# EAGLE design ECG Single Lead board version 6 (EAGLE 9.5.0)
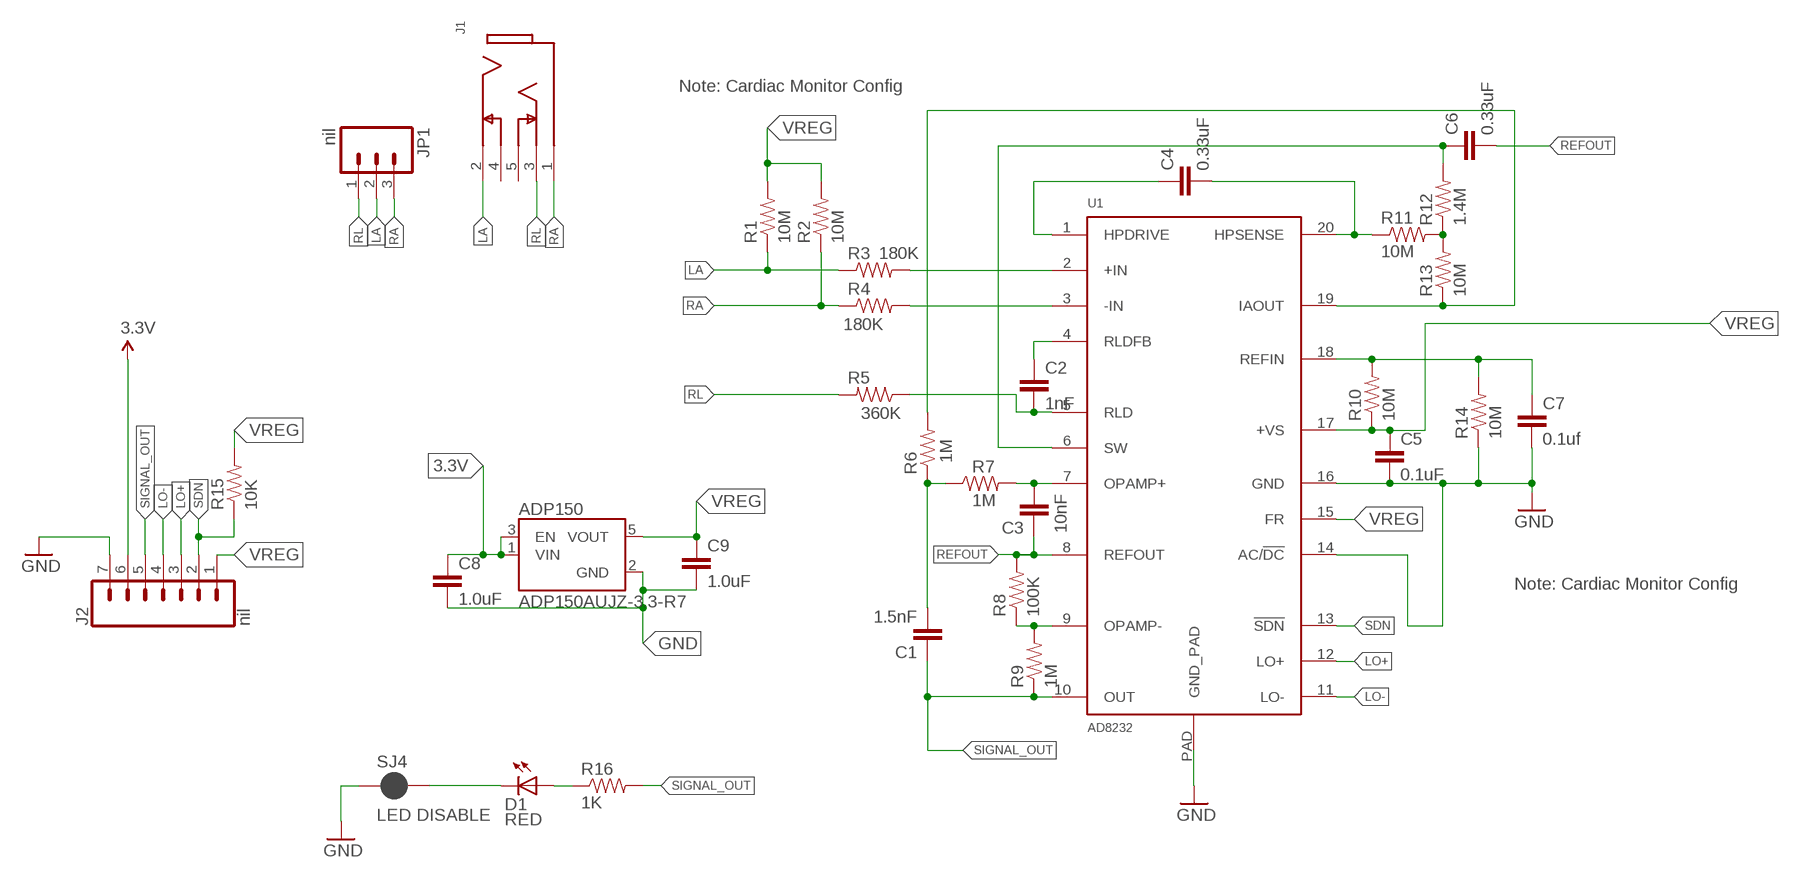
[diagram p0: schematic, sheet 1]

## Parts
ADP150  ADP150AUJZ-3.3-R7  ADP150AUJZ-2.0-R7  [SOT95P280X100-5N]
C1  1.5nF  CAP0603-CAP  [0603-CAP]
C2  1nF  CAP0603-CAP  [0603-CAP]
C3  10nF  CAP0603-CAP  [0603-CAP]
C4  0.33uF  CAP0805  [0805]
C5  0.1uF  CAP0603-CAP  [0603-CAP]
C6  0.33uF  CAP0805  [0805]
C7  0.1uf  CAP0603-CAP  [0603-CAP]
C8  1.0uF  1.0UF-0603-16V-10%  [0603]
C9  1.0uF  1.0UF-0603-16V-10%  [0603]
D1  RED  LED-RED0603  [LED-0603]
J1  35RASMT4BHNTRX  [SWITCHCRAFT_35RASMT4BHNTRX]
J2  nil  CONN_07  [1X07]
JP1  nil  M03PTH  [1X03]
R1  10M  RESISTOR0603-RES  [0603-RES]
R2  10M  RESISTOR0603-RES  [0603-RES]
R3  180K  RESISTOR0603-RES  [0603-RES]
R4  180K  RESISTOR0603-RES  [0603-RES]
R5  360K  RESISTOR0603-RES  [0603-RES]
R6  1M  RESISTOR0603-RES  [0603-RES]
R7  1M  RESISTOR0603-RES  [0603-RES]
R8  100K  RESISTOR0603-RES  [0603-RES]
R9  1M  RESISTOR0603-RES  [0603-RES]
R10  10M  RESISTOR0603-RES  [0603-RES]
R11  10M  RESISTOR0603-RES  [0603-RES]
R12  1.4M  RESISTOR0603-RES  [0603-RES]
R13  10M  RESISTOR0603-RES  [0603-RES]
R14  10M  RESISTOR0603-RES  [0603-RES]
R15  10K  10KOHM1/10W1%(0603)0603  [0603-RES]
R16  1K  1K-1%  [0603-RES]
SJ4  LED DISABLE  JUMPER-SMT_2_NC_PASTE_SILK  [SMT-JUMPER_2_NC_PASTE_SILK]
U1  AD8232  [LFCSP_20]

## Nets
3.3V: ADP150.1(VIN) ADP150.3(EN) C8.1 J2.6
GND: ADP150.2(GND) C5.2 C7.2 C8.2 C9.2 J2.7 R14.1 SJ4.1 U1.14(AC/!DC) U1.16(GND) U1.PAD(GND_PAD)
LA: J1.2 JP1.2 R1.1 R3.1
LO+: J2.3 U1.12(LO+)
LO-: J2.4 U1.11(LO-)
N$1: R3.2 U1.2(+IN)
N$2: R4.2 U1.3(-IN)
N$3: C3.2 R7.2 U1.7(OPAMP+)
N$4: C4.2 R11.1 U1.20(HPSENSE)
N$5: C7.1 R10.2 R14.2 U1.18(REFIN)
N$6: D1.A R16.1
N$7: R8.1 R9.2 U1.9(OPAMP-)
N$8: R6.2 R13.1 U1.19(IAOUT)
N$9: C1.2 R6.1 R7.1
N$10: D1.C SJ4.2
N$13: C4.1 U1.1(HPDRIVE)
N$14: R11.2 R12.1 R13.2
N$16: C6.1 R12.2 U1.6(SW)
N$17: C2.1 U1.4(RLDFB)
N$18: C2.2 R5.1 U1.5(RLD)
RA: J1.1 JP1.3 R2.1 R4.1
REFOUT: C3.1 C6.2 R8.2 U1.8(REFOUT)
RL: J1.3 JP1.1 R5.2
SDN: J2.2 R15.1 U1.13(!SDN)
SIGNAL_OUT: C1.1 J2.5 R9.1 R16.2 U1.10(OUT)
VREG: ADP150.5(VOUT) C5.1 C9.1 J2.1 R1.2 R2.2 R10.1 R15.2 U1.15(FR) U1.17(+VS)
Unconnected: J1.4 J1.5

## Notes on the sheet
- Note: Cardiac Monitor Config
- Note: Cardiac Monitor Config

## Library data of the parts
ADP150 = ADP150AUJZ-2.0-R7:ADP150AUJZ-2.0-R7: IC REG LINEAR 2V 150MA 5TSOT; DESCRIPTION: LDO Regulator Pos 2V 0.15A 5-Pin TSOT T/R; DIGI-KEY_PART_NUMBER: ADP150AUJZ-2.0-R7CT-ND; DIGI-KEY_PURCHASE_URL: https://www.digikey.in/product-detail/en/analog-devices-inc/ADP150AUJZ-2.0-R7/ADP150AUJZ-2.0-R7CT-ND/5583173?utm_source=snapeda&utm_medium=aggregator&utm_campaign=symbol; MF: Analog Devices; MP: ADP150AUJZ-2.0-R7; PACKAGE: TSOT-23 Analog Devices
C1-C7 = SparkFun-Passives:CAP: Capacitor Standard 0603 ceramic capacitor, and 0.1" leaded capacitor.
C8 C9 = SparkFun-Capacitors:1.0UF: 1µF ceramic capacitors A capacitor is a passive two-terminal electrical component used to store electrical energy temporarily in an electric field.; PROD_ID: CAP-00868
D1 = SparkFun-LED:LED-RED: Assorted Red LEDs LilyPad 1206- DIO-09912 1206- DIO-00809 0603- DIO-00819; PROD_ID: DIO-00819
J1 = Switchcraft 3.5 mm smd audio jack:35RASMT4BHNTRX: Conn 3.5MM Stereo Jack F 3 POS Solder RA SMD 5 Terminal 1 Port T/R; AVAILABILITY: Unavailable; DESCRIPTION: Conn 3.5MM Stereo Jack F 3 POS Solder RA SMD 5 Terminal 1 Port T/R; MF: Switchcraft; MP: 35RASMT4BHNTRX; PACKAGE: None; PRICE: None
J2 = SparkFun-Connectors:CONN_07: Multi connection point. Often used as Generic Header-pin footprint for 0.1 inch spaced/style header connections On any of the 0.1 inch spaced packages, you can populate with these: Break Away Headers - Straight <https://www.sparkfun.com/products/116> (PRT-00116) Break Away Male Headers - Right Angle <https://www.sparkfun.com/products/553> (PRT-00553) Female Headers <https://www.sparkfun.com/products/115> (PRT-00115) Break Away Headers - Machine Pin <https://www.sparkfun.com/products/117> (PRT-00117) Break Away Female Headers - Swiss Machine Pin <https://www.sparkfun.com/products/743> (PRT-00743) For SCREWTERMINALS and SPRING TERMINALS visit here: Screw Terimnals on SparkFun.com <https://www.sparkfun.com/search/results?term=Screw+Terminals> (5mm/3.5mm/2.54mm spacing) This device is also useful as a general connection point to wire up your design to another part of your project. Our various solder wires solder well into these plated through hole pads. Hook-Up Wire - Assortment (Stranded, 22 AWG) <https://www.sparkfun.com/products/11375> (PRT-11375) Hook-Up Wire - Assortment (Solid Core, 22 AWG) <https://www.sparkfun.com/products/11367> (PRT-11367) View the entire wire category on our website here <https://www.sparkfun.com/categories/141> Special notes: Molex polarized connector foot print use with SKU : PRT-08231 with associated crimp pins and housings. 1MM SMD Version SKU: PRT-10208 NOTES ON THE VARIANTS LOCK and LOCK_LONGPADS... This footprint was designed to help hold the alignment of a through-hole component (i.e. 6-pin header) while soldering it into place. You may notice that each hole has been shifted either up or down by 0.005 of an inch from it's more standard position (which is a perfectly straight line). This slight alteration caused the pins (the squares in the middle) to touch the edges of the holes. Because they are alternating, it causes a "brace" to hold the component in place. 0.005 has proven to be the perfect amount of "off-center" position when using our standard breakaway headers. Although looks a little odd when you look at the bare footprint, once you have a header in there, the alteration is very hard to notice. Also,if you push a header all the way into place, it is covered up entirely on the bottom side.
JP1 = SparkFun-Connectors:M03: Header 3 Standard 3-pin 0.1" header. Use with straight break away headers (SKU : PRT-00116), right angle break away headers (PRT-00553), swiss pins (PRT-00743), machine pins (PRT-00117), and female headers (PRT-00115). Molex polarized connector foot print use with SKU : PRT-08232 with associated crimp pins and housings.
R1-R14 = SparkFun-Passives:RESISTOR: Resistor Basic schematic elements and footprints for 0603, 1206, and PTH resistors.
R15 = SparkFun-Resistors:10KOHM1/10W1%(0603): RES-00824; PROD_ID: RES-00824
R16 = SparkFun-Resistors:1K-1%: 1k-ohm SMT 1/10W - 1% (0603) RES-07856; PROD_ID: RES-07856; VALUE: 1k
SJ4 = SparkFun-Jumpers:JUMPER-SMT_2_NC_PASTE: Normally closed solder jumper This jumper has an aperture in the stencil to allow solder paste to bridge the split in the wire so it's normally closed (NC). Wick off the solder to open the connection. Reapply solder to reclose the connection.
U1 = AD8232:AD8232

## Board
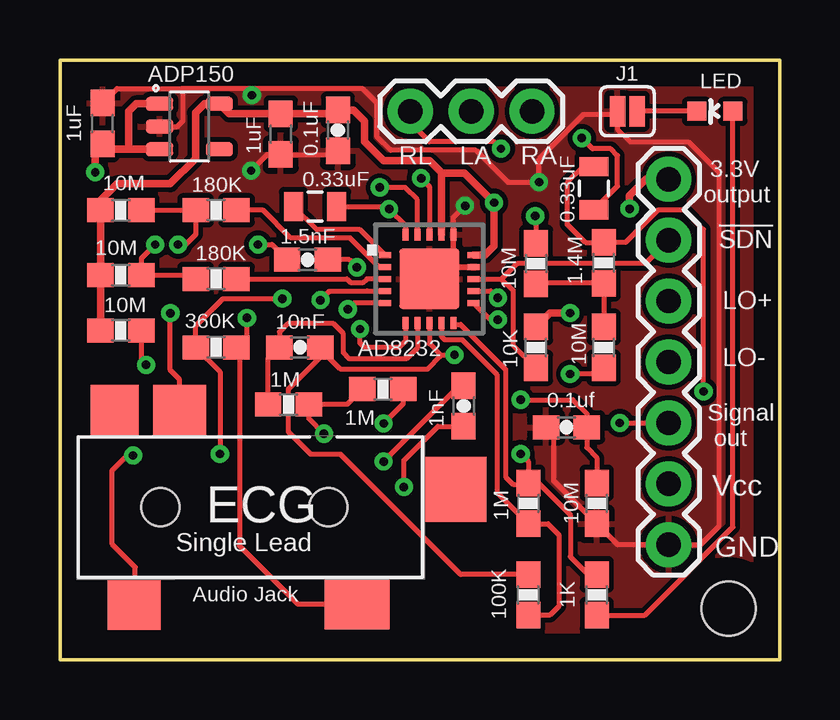
[diagram p1: board, top side]
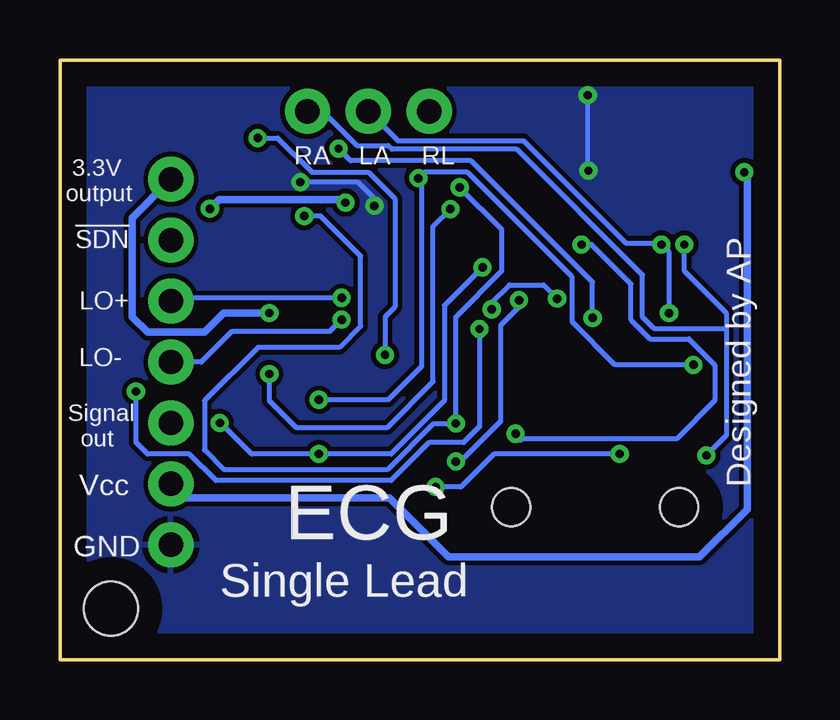
[diagram p2: board, bottom side, seen from below]

Size 30 x 25 mm. Coordinates in mm from the lower left corner, seen from the top.
Outline: 0,0 0,25 30,25 30,0 0,0
Copper layers (1*16): Top 0.035mm / dielectric 1.5mm / Bottom 0.035mm
Design rules "default": minimum track width 6mil, minimum drill 0.35mm, track to track 6mil, track to pad 6mil, pad to pad 6mil, via to via 6mil, smd to smd 6mil, copper to edge 40mil, drill to drill 6mil, minimum pad ring 10mil, minimum via ring 8mil, stop-mask expansion 4mil, vias tented up to drill 0mil, thermal gap 10mil
Holes 2.25 mm at 27.87,2.13

### Footprints (pad centres in the part's own frame; a part is rotated, then mirrored left to right if it is on the bottom)
SOT95P280X100-5N = smd 1.14 x 0.59: 1 -1.245,0.95; 2 -1.245,0; 3 -1.245,-0.95; 4 1.245,-0.95; 5 1.245,0.95
0603-CAP = smd 1.1 x 1: 1 -0.85,0; 2 0.85,0
0805 = smd 0.8 x 1.2: 1 -0.9,0; 2 0.9,0
0603 = smd 1.1 x 1: 1 -0.85,0; 2 0.85,0
LED-0603 = smd 0.8 x 0.8: A 0,-0.75; C 0,0.75
SWITCHCRAFT_35RASMT4BHNTRX = smd 2.2 x 2.1: 1 -4.85,-4.05; 2 -2.95,4.05 | smd 2.7 x 2.1: 3 4.45,-4.048 | smd 2 x 2.1: 4 -5.65,4.05 | smd 2.6 x 2.7: 5 8.553,0.748 | hole 1.6: -3.75,0; 3.25,0
1X07 = drill 1.016 pad 1.88: 1 0,0; 2 2.54,0; 3 5.08,0; 4 7.62,0; 5 10.16,0; 6 12.7,0; 7 15.24,0
1X03 = drill 1.016 pad 1.88: 1 0,0; 2 2.54,0; 3 5.08,0
0603-RES = smd 1.1 x 1: 1 -0.85,0; 2 0.85,0
SMT-JUMPER_2_NC_PASTE_SILK = smd 0.635 x 1.27: 1 -0.406,0; 2 0.406,0
LFCSP_20 = smd 0.5 x 0.25: 1 -1.85,1; 2 -1.85,0.5; 3 -1.85,0; 4 -1.85,-0.5; 5 -1.85,-1; 11 1.85,-1; 12 1.85,-0.5; 13 1.85,0; 14 1.85,0.5; 15 1.85,1 | smd 0.25 x 0.5: 6 -1,-1.85; 7 -0.5,-1.85; 8 0,-1.85; 9 0.5,-1.85; 10 1,-1.85; 16 1,1.85; 17 0.5,1.85; 18 0,1.85; 19 -0.5,1.85; 20 -1,1.85 | smd 2.5 x 2.5: PAD 0,0

### Placement (x,y rotation side)
ADP150  5.4,22.23 0 top
C1  10.32,16.67 180 top
C2  16.83,10.57 270 top
C3  10,13.02 180 top
C4  10.64,18.89 0 top
C5  11.59,22.07 270 top
C6  22.26,19.65 270 top
C7  21.11,9.68 180 top
C8  1.78,22.35 90 top
C9  9.21,21.91 270 top
D1  27.3,22.86 90 top
J1  7.94,6.35 0 top
J2  25.38,20.03 270 top
JP1  14.61,22.86 0 top
R1  2.54,18.73 180 top
R2  2.54,16.03 180 top
R3  6.51,18.73 0 top
R4  6.51,15.88 0 top
R5  6.51,13.02 0 top
R6  13.46,11.27 0 top
R7  9.53,10.64 180 top
R8  19.53,2.7 90 top
R9  19.53,6.51 270 top
R10  2.54,13.72 0 top
R11  22.67,13.02 90 top
R12  22.67,16.54 90 top
R13  19.84,16.51 270 top
R14  22.38,6.51 90 top
R15  19.84,13.02 90 top
R16  22.38,2.7 90 top
SJ4  23.65,22.86 0 top
U1  15.4,15.88 0 top

### Tracks (layer width: path | path; a pad name or v marks a point on that pad's centre or on a via)
3.3V  (via drill 0.35)
  Top 0.305: 2.86,21.27 2,21.27 C8.1 1.47,21.19 v1.47,20.32 | 2.86,21.27 ADP150.3 | ADP150.1 3.17,23.18 2.86,22.86 2.86,21.27
  Bottom 0.305: v1.47,20.32 1.35,20.2 1.35,6.27 3.33,4.29 13.81,4.29 16.26,6.73 24.78,6.73 J2.6
GND  (via drill 0.35)
  Top 0.203: C8.2 2.38,23.81 5.08,23.81 | C5.2 11.43,21.06 C9.2 8.64,21.06 v7.97,20.38 | C7.2 20.58,9.37 20.58,7.46 R14.1 23.26,4.79 J2.7 25.4,4.76 26.67,4.76 27.46,5.56 27.46,20.32 26.19,21.59 23.78,21.59 23.25,22.12 23.25,22.73 | SJ4.1 23.25,22.73 | ADP150.2 4.89,22.23 5.13,22.46 5.13,23.76 5.08,23.81 | U1.PAD 15.9,16.38 U1.14 16.49,16.38 16.35,16.51 16.4,16.56 U1.16 16.4,18.43 v16.89,18.92 | 23.25,22.73 21.85,22.73 19.97,20.86 v19.97,19.91 18.67,19.91 17.34,21.23 13.79,21.23 13.21,21.81 13.21,23.21 12.61,23.81 8,23.81 | 8,23.81 5.08,23.81 | v8,23.53 8,23.81
  Bottom 0.203: v16.89,18.92 16.89,19.21 17.58,19.91 v19.97,19.91 | v7.97,20.38 8,20.41 v8,23.53
  pour Top (isolate 0.203): 0,25 0,0 30,0 30,25
  pour Bottom (isolate 0.203): 0,25 0,0 30,0 30,25
LA  (via drill 0.35)
  Top 0.203: R1.1 R3.1 5.66,17.72 5.24,17.3 v4.92,17.3 | J1.2 4.99,11.68 4.6,12.06 v4.6,14.44
  Bottom 0.203: JP1.2 15.91,21.63 10.67,21.63 6.41,17.37 4.99,17.37 v4.92,17.3 4.79,17.18 4.76,17.14 4.6,16.99 v4.6,14.44
LO+  (via drill 0.35)
  Top 0.203: U1.12 17.96,15.38 v18.26,15.08
  Bottom 0.203: v18.26,15.08 25.24,15.08 J2.3
LO-  (via drill 0.35)
  Top 0.203: U1.11 17.95,14.17 v18.26,14.17
  Bottom 0.203: v18.26,14.17 18.73,13.7 22.82,13.7 24.11,12.41 J2.4
N$1
  Top 0.203: U1.2 13.31,16.38 12.1,17.58 9.62,17.58 8.47,18.73 R3.2
N$2
  Top 0.203: U1.3 12.8,15.88 12.64,15.72 12.12,15.72 11.96,15.88 R4.2
N$3
  Top 0.203: R7.2 8.68,12.54 C3.2 9.15,13.66 9.49,14 11.4,14 11.81,13.59 11.81,12.79 12.06,12.54 14.45,12.54 14.9,12.99 U1.7
N$4  (via drill 0.35)
  Top 0.203: R11.1 22.41,11.91 v21.27,11.91 | U1.20 14.4,18.11 v13.72,18.79 13.62,18.89 C4.2
  Bottom 0.203: v21.27,11.91 21.27,10.79 20.16,9.68 16.35,9.68 14.45,11.59 14.45,18.07 v13.72,18.79
N$5  (via drill 0.35)
  Top 0.203: R14.2 22.38,8.41 21.96,8.83 C7.1 21.96,10.26 21.39,10.83 v19.21,10.83 | v15.06,20.07 15.4,19.73 U1.18 | R10.2 3.39,12.48 v3.59,12.29
  Bottom 0.203: v3.59,12.29 6.86,12.29 8.64,14.06 8.64,15.94 13.02,20.32 14.81,20.32 v15.06,20.07 14.92,19.93 14.92,12.22 16.31,10.83 v19.21,10.83
N$6
  Top 0.203: R16.1 24.38,1.85 28.05,5.53 D1.A
N$7
  Top 0.203: U1.9 15.9,13.47 16.03,13.34 16.76,13.34 18.22,11.88 18.22,6.97 R9.2 20.34,5.66 20.8,5.21 20.8,2.22 20.42,1.85 R8.1
N$8  (via drill 0.35)
  Top 0.203: R6.2 14.31,10.66 v13.49,9.84 | v13.34,19.68 14.39,19.68 14.9,19.17 U1.19 | v19.81,18.49 19.84,18.46 R13.1
  Bottom 0.203: v13.34,19.68 11.59,17.94 11.59,16.19 13.49,14.29 v13.49,9.84 14.42,9.84 16.32,7.94 23.18,7.94 23.97,8.73 23.97,10.79 21.75,13.02 18.35,13.02 17.46,13.91 17.46,16.83 19.13,18.49 v19.81,18.49
N$9  (via drill 0.35)
  Top 0.203: R6.1 11.98,10.64 R7.1 10.38,10.04 v11,9.42 | v8.26,17.3 8.83,17.3 C1.2
  Bottom 0.203: 10.79,9.21 4.29,9.21 2.7,10.79 2.7,12.29 3.78,13.37 5.4,13.37 6.19,14.16 6.19,15.66 7.84,17.3 v8.26,17.3
  Bottom 0.305: 10.79,9.21 v11,9.42
N$10
  Top 0.203: D1.C SJ4.2
N$13
  Top 0.203: C4.1 10.69,17.94 12.48,17.94 U1.1
N$14
  Top 0.203: R13.2 19.88,15.69 R12.1 R11.2
N$16  (via drill 0.35)
  Top 0.203: C6.1 21.82,20.55 21.14,19.88 21.14,18.15 21.91,17.39 R12.2 23.58,17.39 24.92,18.73 26.04,18.73 26.83,17.94 v26.83,11.18 | U1.6 14.4,13.29 14.13,13.02 12.7,13.02 12.51,13.21 v12.51,13.78
  Bottom 0.203: v12.51,13.78 12.51,9.72 13.18,9.05 14.61,9.05 16.19,7.46 23.5,7.46 24.61,8.57 26.35,8.57 26.83,9.05 v26.83,11.18
N$17  (via drill 0.35)
  Top 0.203: C2.1 16.66,11.42 v13.49,8.26 | U1.4 12.8,15.38 12.79,15.36 11.24,15.36 v10.86,14.99
  Bottom 0.203: v13.49,8.26 13.31,8.26 11.62,9.94 11.62,13.94 10.86,14.7 v10.86,14.99
N$18  (via drill 0.35)
  Top 0.203: v6.67,8.57 6.67,12.01 R5.1 5.66,13.91 6.79,15.05 v9.27,15.05 | C2.2 15.76,9.72 14.34,8.3 v14.34,7.19 | v12,14.61 12.27,14.88 U1.5
  Bottom 0.203: v6.67,8.57 11.91,8.57 13.29,7.19 v14.34,7.19 | v9.27,15.05 9.84,15.62 11.27,15.62 12,14.89 v12,14.61
RA  (via drill 0.35)
  Top 0.203: R4.1 5.5,16.03 R2.1 3.39,16.73 v3.97,17.3 | v3.05,8.51 2.79,8.51 2.16,7.87 2.16,4.83 3.14,3.85 3.14,2.25 J1.1
  Bottom 0.203: 2.22,13.81 2.22,14.45 3.97,16.19 v3.97,17.3 | JP1.3 19.05,22.86 17.62,21.43 16.32,21.43 16.16,21.27 10.95,21.27 5.71,16.03 5.71,14.29 5.24,13.81 2.22,13.81 | v3.05,8.51 2.22,9.34 2.22,13.81
REFOUT  (via drill 0.35)
  Top 0.203: R8.2 16.71,3.55 11.68,8.57 10.45,8.57 9.53,9.49 9.53,11.27 10.85,12.6 10.85,12.95 | 10.85,12.95 C3.1 | U1.8 15.4,13.18 15.87,12.7 | C6.2 23.24,19.74 23.24,21.02 22.96,21.3 22.2,21.3 v21.75,21.74 | 10.85,12.95 11.68,12.12 15.35,12.12 15.87,12.65 15.87,12.7 | 15.87,12.7 v16.45,12.7
  Bottom 0.203: v21.75,21.74 20.92,21.74 19.49,20.32 17.14,20.32 16.03,19.21 16.03,14.7 16.45,14.29 v16.45,12.7
RL  (via drill 0.35)
  Top 0.203: J1.3 9.92,2.3 7.49,4.74 7.49,12.89 R5.2 7.79,13.45 v7.79,14.24 | JP1.1 14.61,22.38 15.4,21.59 18.1,21.59 v18.39,21.3
  Bottom 0.203: v7.79,14.24 7.79,15.73 12.86,20.8 17.88,20.8 v18.39,21.3
SDN
  Top 0.203: R15.1 18.89,13.12 18.89,15.4 18.41,15.88 | U1.13 18.41,15.88 | J2.2 24.4,16.51 19.05,16.51 18.41,15.88
SIGNAL_OUT  (via drill 0.35)
  Top 0.203: U1.10 16.45,13.97 16.7,13.97 18.57,12.1 18.57,7.62 18.89,7.3 19.47,7.3 R9.1 | C1.1 12.06,16.67 v12.38,16.35 | v19.21,8.57 19.53,8.26 R9.1 | R9.1 19.95,7.36 21.27,6.03 21.27,4.29 22.01,3.55 R16.2 | v23.34,9.87 J2.5
  Bottom 0.203: v12.38,16.35 13.97,14.76 13.97,10.79 16.19,8.57 v19.21,8.57 22,8.57 23.3,9.87 v23.34,9.87
VREG  (via drill 0.35)
  Top 0.305: U1.17 15.9,20.29 | 15.9,20.29 15.9,20.3 15.4,20.8 13.49,20.8 12.7,21.59 12.7,22.45 12.23,22.92 C5.1 11.43,22.76 C9.1 7.06,22.76 ADP150.5 6.03,23.18 5.65,22.8 5.65,20.89 4.6,19.84 2.38,19.84 1.69,19.15 R1.2 R2.2 R10.1 | R15.2 20.42,14.45 v21.27,14.45 | U1.15 17.73,16.88 18.1,17.25 v18.1,19.05 16.86,20.29 15.9,20.29 | J2.1 24.42,20.03 23.75,19.35 v23.75,18.8
  Bottom 0.305: v21.27,14.45 23.18,14.45 23.97,13.65 26.35,13.65 26.99,14.29 26.99,18.41 J2.1 | v18.1,19.05 18.22,19.18 23.37,19.18 v23.75,18.8

### Text on the board
tNames: J1 | LED | 1uF | 1uF | RL | LA | RA | 3.3V / output | . | !SDN! | LO+ | AD8232 | LO- | Signal / out | Vcc | ECG | Single Lead | GND | Audio Jack
bNames: RL | LA | RA | 3.3V / output | Designed by AP | !SDN! | LO+ | LO- | Signal / out | Vcc | ECG | GND | Single Lead